# EasyEDA schematic V71_XplainedUltra_CAN_Shield.json
TITLE: V71 XplainedUltra CAN Shield; REV: 1.0; Date: 2023-05-06; Sheet: 1/1; Company: N/A
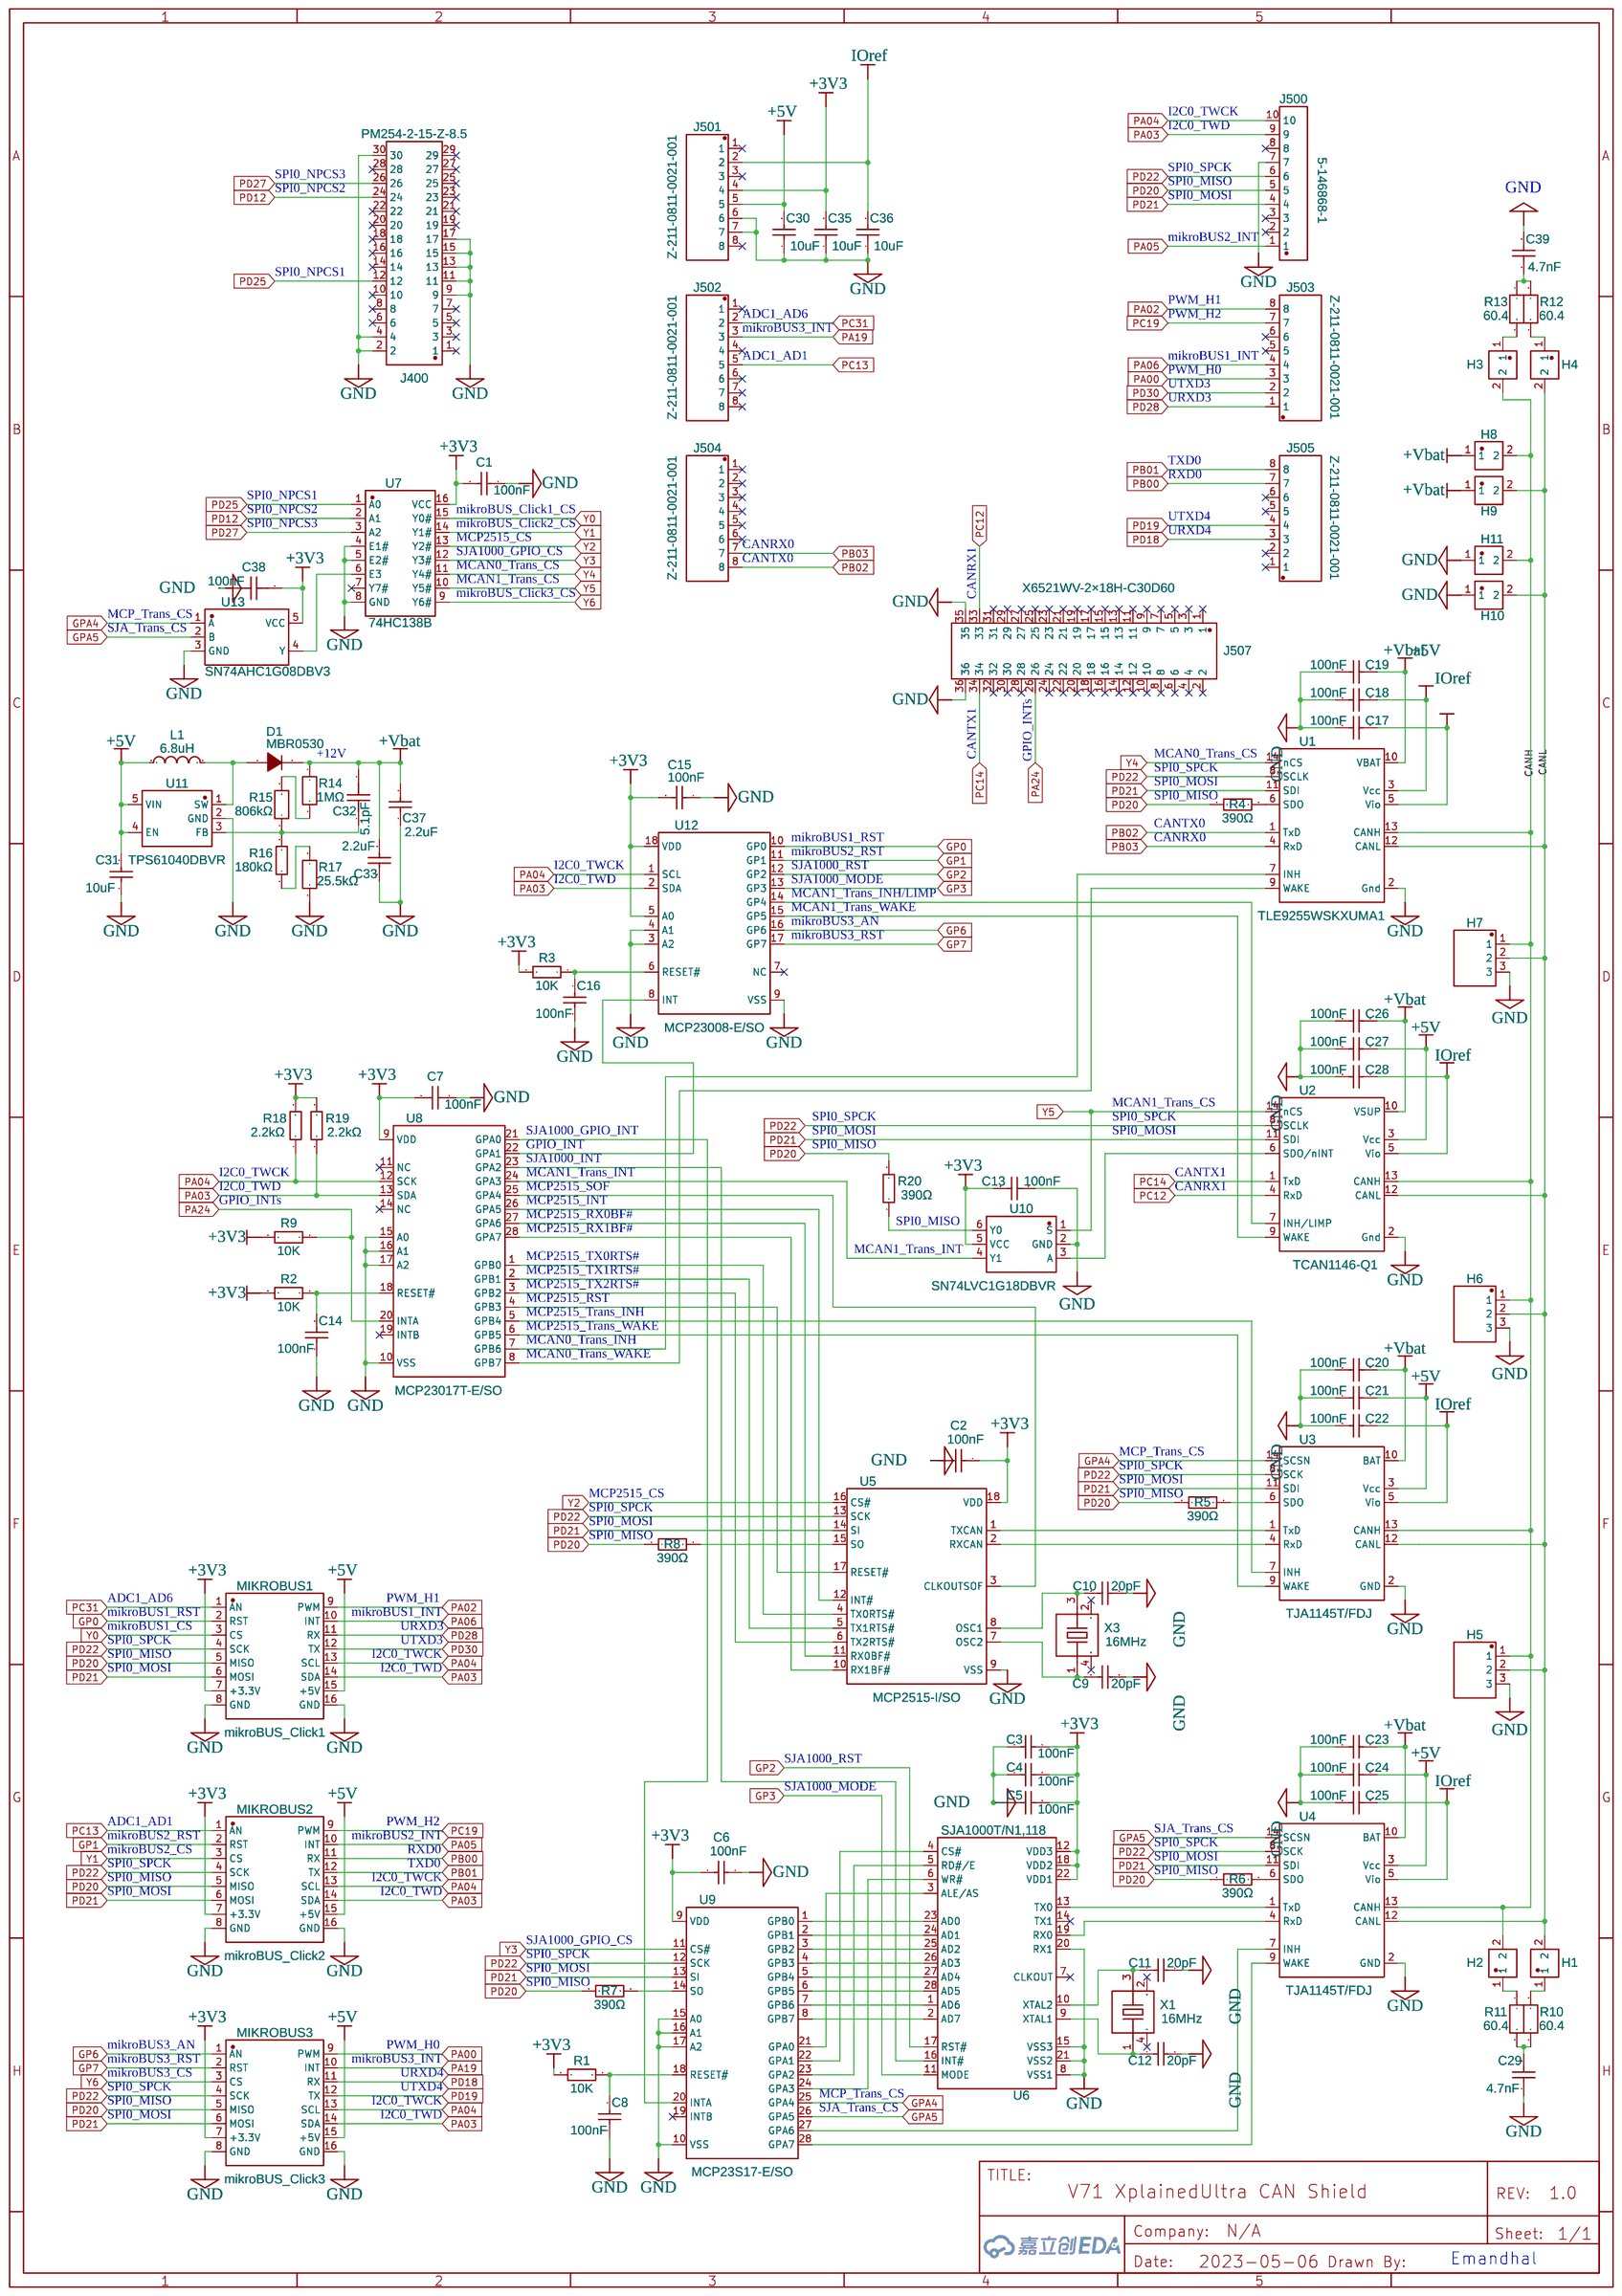
[diagram p0: schematic sheet]

## Parts
C1  100nF  [C0805]
C2  100nF  [C0805]
C3  100nF  [C0805]
C4  100nF  [C0805]
C5  100nF  [C0805]
C6  100nF  [C0805]
C7  100nF  [C0805]
C8  100nF  [C0805]
C9  20pF  [C0603]
C10  20pF  [C0603]
C11  20pF  [C0603]
C12  20pF  [C0603]
C13  100nF  [C0805]
C14  100nF  [C0805]
C15  100nF  [C0805]
C16  100nF  [C0805]
C17  100nF  [C0805]
C18  100nF  [C0805]
C19  100nF  [C0805]
C20  100nF  [C0805]
C21  100nF  [C0805]
C22  100nF  [C0805]
C23  100nF  [C0805]
C24  100nF  [C0805]
C25  100nF  [C0805]
C26  100nF  [C0805]
C27  100nF  [C0805]
C28  100nF  [C0805]
C29  4.7nF  [C0805]
C30  10uF  [C0805]
C31  10uF  [C0805]
C32  5.1pF  [C0805]
C33  2.2uF  [C0805]
C35  10uF  [C0805]
C36  10uF  [C0805]
C37  2.2uF  [C0805]
C38  100nF  [C0805]
C39  4.7nF  [C0805]
D1  MBR0530  [SOD-123_L2.8-W1.8-LS3.7-RD]
H1  X6521WV-2X01H-C30D60  [HDR-TH_2P-P2.54-V-M]
H2  X6521WV-2X01H-C30D60  [HDR-TH_2P-P2.54-V-M]
H3  X6521WV-2X01H-C30D60  [HDR-TH_2P-P2.54-V-M]
H4  X6521WV-2X01H-C30D60  [HDR-TH_2P-P2.54-V-M]
H5  77311-102-03LF  [HDR-TH_3P-P2.54-V-M-1]
H6  77311-102-03LF  [HDR-TH_3P-P2.54-V-M-1]
H7  77311-102-03LF  [HDR-TH_3P-P2.54-V-M-1]
H8  X6521WV-2X01H-C30D60  [HDR-TH_2P-P2.54-V-M]
H9  X6521WV-2X01H-C30D60  [HDR-TH_2P-P2.54-V-M]
H10  X6521WV-2X01H-C30D60  [HDR-TH_2P-P2.54-V-M]
H11  X6521WV-2X01H-C30D60  [HDR-TH_2P-P2.54-V-M]
J400  PM254-2-15-Z-8.5  [HDR-TH_30P-P2.54-V-F-R2-C15-S2.54-2]
J500  5-146868-1  [HDR-TH_10P-P2.54-V-M-1]
J501  Z-211-0811-0021-001  [HDR-TH_8P-P2.54-V-M]
J502  Z-211-0811-0021-001  [HDR-TH_8P-P2.54-V-M]
J503  Z-211-0811-0021-001  [HDR-TH_8P-P2.54-V-M]
J504  Z-211-0811-0021-001  [HDR-TH_8P-P2.54-V-M]
J505  Z-211-0811-0021-001  [HDR-TH_8P-P2.54-V-M]
J507  X6521WV-2×18H-C30D60  [HDR-TH_36P-2.54-V-M-R2-C18-S2.54]
L1  6.8uH  [IND-SMD_L2.0-W1.3]
MIKROBUS1  mikroBUS_Click1  [MIKROE-CLICK-HEADER]
MIKROBUS2  mikroBUS_Click2  [MIKROE-CLICK-HEADER]
MIKROBUS3  mikroBUS_Click3  [MIKROE-CLICK-HEADER]
R1  10K  [R0805]
R2  10K  [R0805]
R3  10K  [R0805]
R4  390Ω  [R0805]
R5  390Ω  [R0805]
R6  390Ω  [R0805]
R7  390Ω  [R0805]
R8  390Ω  [R0805]
R9  10K  [R0805]
R10  60.4  [R0603]
R11  60.4  [R0603]
R12  60.4  [R0603]
R13  60.4  [R0603]
R14  1MΩ  [R0805]
R15  806kΩ  [R0805]
R16  180kΩ  [R0805]
R17  25.5kΩ  [R0805]
R18  2.2kΩ  [R0805]
R19  2.2kΩ  [R0805]
R20  390Ω  [R0805]
U1  TLE9255WSKXUMA1  [SOIC-14_L8.7-W3.9-P1.27-LS6.0-BL]
U2  TCAN1146-Q1  [SOIC-14_L8.7-W3.9-P1.27-LS6.0-BL]
U3  TJA1145T/FDJ  [SOIC-14_L8.7-W3.9-P1.27-LS6.0-BL]
U4  TJA1145T/FDJ  [SOIC-14_L8.7-W3.9-P1.27-LS6.0-BL]
U5  MCP2515-I/SO  [SOIC-18_L11.6-W7.5-P1.27-LS10.3-BL]
U6  SJA1000T/N1,118  [SOIC-28_L17.9-W7.5-P1.27-LS10.3-BL]
U7  74HC138B  [SOP-16_L9.9-W3.9-P1.27-LS6.0-BL]
U8  MCP23017T-E/SO  [SOIC-28_L17.9-W7.5-P1.27-LS10.3-BL]
U9  MCP23S17-E/SO  [SOIC-28_L17.9-W7.5-P1.27-LS10.3-BL]
U10  SN74LVC1G18DBVR  [SOT-23-6_L2.9-W1.6-P0.95-LS2.8-BR]
U11  TPS61040DBVR  [SOT-23-5_L3.0-W1.7-P0.95-LS2.8-BL]
U12  MCP23008-E/SO  [SOIC-18_L11.6-W7.5-P1.27-LS10.3-BL]
U13  SN74AHC1G08DBV3  [SOT-23-5_L2.9-W1.6-P0.95-LS2.8-BR]
X1  16MHz  [CRYSTAL-SMD_4P-L3.2-W2.5-BL-2]
X3  16MHz  [CRYSTAL-SMD_4P-L3.2-W2.5-BL-2]

## Library data of the parts
C1-C8 C13-C28 = CC0805KRX7R9BB104: Supplier: LCSC; Manufacturer: YAGEO(国巨); Supplier Part: C49678; JLCPCB Part Class: Basic Part
C9-C12 = CL10C200JB8NNNC: Supplier: LCSC; Manufacturer: SAMSUNG(三星); Supplier Part: C1648; JLCPCB Part Class: Basic Part
C29 C39 = 0805B472K500NT: Supplier: LCSC; Manufacturer: FH(风华); Supplier Part: C1744; JLCPCB Part Class: Basic Part
C30 C31 C35 C36 = CL21A106KAYNNNE: Supplier: LCSC; Manufacturer: SAMSUNG(三星); Supplier Part: C15850; JLCPCB Part Class: Basic Part
C32 = CC0805CRNPO9BN5R1: Supplier: LCSC; Supplier Part: C519941; Manufacturer: YAGEO(国巨); Contributor: LCSC; JLCPCB Part Class: Extended Part
C33 C37 = 0805F225M500NT: Supplier: LCSC; Manufacturer: FH(风华); Supplier Part: C49217; JLCPCB Part Class: Basic Part
C38 = CC0805KRX7R7BB104: Supplier: LCSC; Supplier Part: C519980; Manufacturer: YAGEO(国巨); JLCPCB Part Class: Extended Part; Contributor: LCSC
D1 = MBR0530: Supplier: LCSC; Manufacturer: CJ(江苏长电/长晶); Supplier Part: C77336; JLCPCB Part Class: Extended Part
H1-H4 H8-H11 = X6521WV-2X01H-C30D60: Supplier: LCSC; Supplier Part: C2883961; Manufacturer: XKB Connectivity(中国星坤); Manufacturer Part: X6521WV-2x01H-C30D60; link: https://atta.szlcsc.com/upload/public/pdf/source/20211009/DE33EBA4104B5B447A7BD8383FBBA145.pdf; Contributor: LCSC; JLCPCB Part Class: Extended Part
H5-H7 = 77311-102-03LF: Supplier: LCSC; Supplier Part: C180248; Manufacturer: Amphenol; Contributor: LCSC; JLCPCB Part Class: Extended Part
J400 = PM254-2-15-Z-8.5: Supplier: LCSC; Supplier Part: C2897416; Manufacturer: HCTL(华灿天禄); Contributor: LCSC; JLCPCB Part Class: Extended Part
J500 = 5-146868-1: Supplier: LCSC; Supplier Part: C429850; Manufacturer: TE Connectivity(美国泰科); Contributor: LCSC; JLCPCB Part Class: Extended Part
J501-J505 = Z-211-0811-0021-001: Supplier: LCSC; Supplier Part: C190820; Manufacturer: Nextron(正凌); Contributor: LCSC; JLCPCB Part Class: Extended Part
J507 = X6521WV-2×18H-C30D60: Supplier: LCSC; Supplier Part: C725890; Manufacturer: XKB Connectivity(中国星坤); Manufacturer Part: X6521WV-2x18H-C30D60; Contributor: LCSC; JLCPCB Part Class: Extended Part
L1 = MLZ2012N6R8LT000: Supplier: LCSC; Supplier Part: C82157; Manufacturer: TDK; Contributor: LCSC; JLCPCB Part Class: Extended Part
MIKROBUS1-MIKROBUS3 = MIKROE-CLICK-HEADER: Contributor: philbobagins
R1-R3 R9 = RT0805BRD0710KL: Supplier: LCSC; Manufacturer: YAGEO(国巨); Supplier Part: C110775; JLCPCB Part Class: Extended Part; Resistance: 10kΩ
R4-R8 R20 = 0805W8F3900T5E: Supplier: LCSC; Manufacturer: UNI-ROYAL(厚声); Supplier Part: C17655; Resistance (Ohms): 390; JLCPCB Part Class: Basic Part
R10-R13 = AC0603DR-0760R4L: Supplier: LCSC; Supplier Part: C227513; Manufacturer: YAGEO(国巨); Contributor: LCSC; JLCPCB Part Class: Extended Part; Resistance: 60.4Ω
R14 = CR-05FL7----1M: Supplier: LCSC; Supplier Part: C416080; Manufacturer: Viking(光颉); Resistance (Ohms): 1M; Contributor: LCSC; JLCPCB Part Class: Extended Part
R15 = WR08X8063FTL: Supplier: LCSC; Supplier Part: C368003; Manufacturer: Walsin(华新科); Resistance (Ohms): 806K; Contributor: LCSC; JLCPCB Part Class: Extended Part
R16 = RK73B2ATTD184J: Supplier: LCSC; Supplier Part: C316809; Manufacturer: KOA; Resistance (Ohms): 180K; Contributor: LCSC; JLCPCB Part Class: Extended Part
R17 = TE05H2552BT: Supplier: LCSC; Supplier Part: C880427; Manufacturer: FH(风华); Contributor: LCSC; JLCPCB Part Class: Extended Part
R18 R19 = AR05BTB2201: Supplier: LCSC; Supplier Part: C374634; Manufacturer: Viking(光颉); Resistance (Ohms): 2.2K; Contributor: LCSC; JLCPCB Part Class: Extended Part
U1 = TLE9255WSKXUMA1: Supplier: LCSC; Supplier Part: C2671952; Manufacturer: Infineon(英飞凌); Contributor: Emandhal; JLCPCB Part Class: Extended Part; link: https://www.infineon.com/dgdl/Infineon-TLE9255W-DataSheet-v01_04-EN.pdf?fileId=5546d4625bd71aa0015c10eaeaf93ee5
U2 = TCAN1146-Q1: Contributor: Emandhal; Manufacturer Part: TCAN1146D-Q1; Supplier: LCSC; Supplier Part: C3234147; Manufacturer: Texas Instruments; link: https://www.ti.com/lit/ds/symlink/tcan1145-q1.pdf?ts=1683312657919
U3 U4 = TJA1145T/FDJ: Supplier: LCSC; Manufacturer: NXP(恩智浦); Supplier Part: C131479; JLCPCB Part Class: Extended Part; link: https://www.nxp.com/docs/en/data-sheet/TJA1145.pdf; Contributor: Emandhal
U5 = MCP2515-I/SO: Supplier: LCSC; Manufacturer: MICROCHIP(美国微芯); Supplier Part: C12368; JLCPCB Part Class: Extended Part; link: https://ww1.microchip.com/downloads/en/DeviceDoc/MCP2515-Stand-Alone-CAN-Controller-with-SPI-20001801J.pdf; Contributor: Emandhal
U6 = SJA1000T/N1,118: Supplier: LCSC; Manufacturer: NXP(恩智浦); Supplier Part: C6910; JLCPCB Part Class: Extended Part; link: https://www.nxp.com/docs/en/data-sheet/SJA1000.pdf; Contributor: Emandhal
U7 = 74HC138B: Supplier: LCSC; Supplier Part: C2906780; Manufacturer: FM(富满); Contributor: LCSC; JLCPCB Part Class: Extended Part
U8 = MCP23017T-E/SO: Supplier: LCSC; Supplier Part: C629440; Manufacturer: MICROCHIP(美国微芯); link: https://atta.szlcsc.com/upload/public/pdf/source/20220321/B5AAACE49E79FD7FA33208C446BB37B2.pdf; Contributor: Emandhal; JLCPCB Part Class: Extended Part
U9 = MCP23S17-E/SO: Supplier: LCSC; Manufacturer: MICROCHIP(美国微芯); Contributor: Emandhal; Supplier Part: C145413; JLCPCB Part Class: Extended Part
U10 = SN74LVC1G18DBVR: Supplier: LCSC; Supplier Part: C2674690; Manufacturer: TI(德州仪器); JLCPCB Part Class: Extended Part; Contributor: LCSC
U11 = TPS61040DBVR: Supplier: LCSC; Manufacturer: TI(德州仪器); Supplier Part: C7722; JLCPCB Part Class: Basic Part
U12 = MCP23008-E/SO: Supplier: LCSC; Manufacturer: MICROCHIP(美国微芯); Contributor: Emandhal; Supplier Part: C92253; JLCPCB Part Class: Extended Part
U13 = SN74AHC1G08DBV3: Supplier: LCSC; Supplier Part: C2877867; Manufacturer: TI(德州仪器); link: https://atta.szlcsc.comnull; Contributor: LCSC; JLCPCB Part Class: Extended Part
X1 X3 = NX3225SA-16MHZ-STD-CSR-6: Supplier: LCSC; Supplier Part: C880097; Manufacturer: NDK; Manufacturer Part: NX3225SA-16MHz-STD-CSR-6; Contributor: Emandhal; JLCPCB Part Class: Extended Part

## Nets
+3V3: C1.2 C2.1 C3.1 C4.1 C5.1 C6.2 C7.2 C13.2 C15.2 C35.2 C38.1 J501.4 MIKROBUS1.7(+3.3V) MIKROBUS2.7(+3.3V) MIKROBUS3.7(+3.3V) R1.2 R2.2 R3.2 R9.2 R18.2 R19.2 U5.18(VDD) U6.12(VDD3) U6.18(VDD2) U6.22(VDD1) U7.16(VCC) U8.9(VDD) U9.9(VDD) U10.5(VCC) U12.5(A0) U12.18(VDD) U13.5(VCC)
+5V: C18.1 C21.1 C24.1 C27.1 C30.2 C31.2 J501.5 L1.1 MIKROBUS1.15(+5V) MIKROBUS2.15(+5V) MIKROBUS3.15(+5V) U1.3(Vcc) U2.3(Vcc) U3.3(Vcc) U4.3(Vcc) U11.4(EN) U11.5(VIN)
+Vbat: C19.1 C20.1 C23.1 C26.1 C32.2 C33.2 C37.2 D1.1(C) H8.1 H9.1 R14.2 U1.10(VBAT) U2.10(VSUP) U3.10(BAT) U4.10(BAT)
GND: C1.1 C2.2 C3.2 C4.2 C5.2 C6.1 C7.1 C8.1 C9.2 C10.2 C11.2 C12.2 C13.1 C14.1 C15.1 C16.1 C17.2 C18.2 C19.2 C20.2 C21.2 C22.2 C23.2 C24.2 C25.2 C26.2 C27.2 C28.2 C29.1 C30.1 C31.1 C33.1 C35.1 C36.1 C37.1 C38.2 C39.2 H5.3 H6.3 H7.3 H10.1 H11.1 J400.2 J400.4 J400.9 J400.11 J400.13 J400.15 J400.17 J400.30 J500.7 J501.6 J501.7 J507.35 J507.36 MIKROBUS1.8(GND) MIKROBUS1.16(GND) MIKROBUS2.8(GND) MIKROBUS2.16(GND) MIKROBUS3.8(GND) MIKROBUS3.16(GND) R17.1 U1.2(Gnd) U2.2(Gnd) U3.2(GND) U4.2(GND) U5.9(VSS) U6.8(VSS1) U6.15(VSS3) U6.20(RX1) U6.21(VSS2) U7.4(E1#) U7.5(E2#) U7.8(GND) U8.10(VSS) U8.15(A0) U8.16(A1) U8.17(A2) U9.10(VSS) U9.15(A0) U9.16(A1) U9.17(A2) U10.2(GND) U11.2(GND) U12.3(A2) U12.4(A1) U12.9(VSS) U13.3(GND)
CANH: H2.2 H3.2 H5.1 H6.1 H7.1 H8.2 H11.2 U1.13(CANH) U2.13(CANH) U3.13(CANH) U4.13(CANH)
CANL: H1.2 H4.2 H5.2 H6.2 H7.2 H9.2 H10.2 U1.12(CANL) U2.12(CANL) U3.12(CANL) U4.12(CANL)
GP0: MIKROBUS1.2(RST) U12.10(GP0)
GP1: MIKROBUS2.2(RST) U12.11(GP1)
GP2: U6.17(RST#) U12.12(GP2)
GP3: U6.11(MODE) U12.13(GP3)
GP6: MIKROBUS3.1(AN) U12.16(GP6)
GP7: MIKROBUS3.2(RST) U12.17(GP7)
GPA4: U3.14(SCSN) U9.25(GPA4) U13.1(A)
GPA5: U4.14(SCSN) U9.26(GPA5) U13.2(B)
IOref: C17.1 C22.1 C25.1 C28.1 C36.2 J501.2 U1.5(Vio) U2.5(Vio) U3.5(Vio) U4.5(Vio)
PA00: J503.3 MIKROBUS3.9(PWM)
PA02: J503.8 MIKROBUS1.9(PWM)
PA03: J500.9 MIKROBUS1.14(SDA) MIKROBUS2.14(SDA) MIKROBUS3.14(SDA) R19.1 U8.13(SDA) U12.2(SDA)
PA04: J500.10 MIKROBUS1.13(SCL) MIKROBUS2.13(SCL) MIKROBUS3.13(SCL) R18.1 U8.12(SCK) U12.1(SCL)
PA05: J500.1 MIKROBUS2.10(INT)
PA06: J503.4 MIKROBUS1.10(INT)
PA19: J502.3 MIKROBUS3.10(INT)
PA24: J507.26 R9.1 U8.20(INTA)
PB00: J505.7 MIKROBUS2.11(RX)
PB01: J505.8 MIKROBUS2.12(TX)
PB02: J504.8 U1.1(TxD)
PB03: J504.7 U1.4(RxD)
PC12: J507.33 U2.4(RxD)
PC13: J502.5 MIKROBUS2.1(AN)
PC14: J507.34 U2.1(TxD)
PC19: J503.7 MIKROBUS2.9(PWM)
PC31: J502.2 MIKROBUS1.1(AN)
PD12: J400.24 U7.2(A1)
PD18: J505.3 MIKROBUS3.11(RX)
PD19: J505.4 MIKROBUS3.12(TX)
PD20: J500.5 MIKROBUS1.5(MISO) MIKROBUS2.5(MISO) MIKROBUS3.5(MISO) R4.1 R5.1 R6.1 R7.1 R8.1 R20.2
PD21: J500.4 MIKROBUS1.6(MOSI) MIKROBUS2.6(MOSI) MIKROBUS3.6(MOSI) U1.11(SDI) U2.11(SDI) U3.11(SDI) U4.11(SDI) U5.14(SI) U9.13(SI)
PD22: J500.6 MIKROBUS1.4(SCK) MIKROBUS2.4(SCK) MIKROBUS3.4(SCK) U1.8(SCLK) U2.8(SCLK) U3.8(SCK) U4.8(SCK) U5.13(SCK) U9.12(SCK)
PD25: J400.12 U7.1(A0)
PD27: J400.26 U7.3(A2)
PD28: J503.1 MIKROBUS1.11(RX)
PD30: J503.2 MIKROBUS1.12(TX)
Y0: MIKROBUS1.3(CS) U7.15(Y0#)
Y1: MIKROBUS2.3(CS) U7.14(Y1#)
Y2: U5.16(CS#) U7.13(Y2#)
Y3: U7.12(Y3#) U9.11(CS#)
Y4: U1.14(nCS) U7.11(Y4#)
Y5: U2.14(nCS) U7.10(Y5#) U10.1(S)
Y6: MIKROBUS3.3(CS) U7.9(Y6#)
Net-(C8-2): C8.2 R1.1 U9.18(RESET#)
Net-(C9-1): C9.1 U5.7(OSC2) X3.1
Net-(C10-1): C10.1 U5.8(OSC1) X3.3
Net-(C11-1): C11.1 U6.10(XTAL2) X1.3
Net-(C12-1): C12.1 U6.9(XTAL1) X1.1
Net-(C14-2): C14.2 R2.1 U8.18(RESET#)
Net-(C16-2): C16.2 R3.1 U12.6(RESET#)
Net-(C29-2): C29.2 R10.1 R11.2
Net-(C32-1): C32.1 R15.1 R16.2 U11.3(FB)
Net-(C39-1): C39.1 R12.2 R13.1
Net-(D1-2): D1.2(A) L1.2 U11.1(SW)
Net-(H1-1): H1.1 R10.2
Net-(H2-1): H2.1 R11.1
Net-(H3-1): H3.1 R13.2
Net-(H4-1): H4.1 R12.1
Net-(R4-2): R4.2 U1.6(SDO)
Net-(R5-2): R5.2 U3.6(SDO)
Net-(R6-2): R6.2 U4.6(SDO)
Net-(R7-2): R7.2 U9.14(SO)
Net-(R8-2): R8.2 U5.15(SO)
Net-(R14-1): R14.1 R15.2
Net-(R16-1): R16.1 R17.2
Net-(R20-1): R20.1 U10.6(Y0)
Net-(U1-7): U1.7(INH) U8.7(GPB6)
Net-(U1-9): U1.9(WAKE) U8.8(GPB7)
Net-(U2-6): U2.6(SDO/nINT) U10.3(A)
Net-(U2-7): U2.7(INH/LIMP) U12.14(GP4)
Net-(U2-9): U2.9(WAKE) U12.15(GP5)
Net-(U3-1): U3.1(TxD) U5.1(TXCAN)
Net-(U3-4): U3.4(RxD) U5.2(RXCAN)
Net-(U3-7): U3.7(INH) U8.5(GPB4)
Net-(U3-9): U3.9(WAKE) U8.6(GPB5)
Net-(U4-1): U4.1(TxD) U6.13(TX0)
Net-(U4-4): U4.4(RxD) U6.19(RX0)
Net-(U4-7): U4.7(INH) U9.27(GPA6)
Net-(U4-9): U4.9(WAKE) U9.28(GPA7)
Net-(U5-3): U5.3(CLKOUTSOF) U8.25(GPA4)
Net-(U5-4): U5.4(TX0RTS#) U8.1(GPB0)
Net-(U5-5): U5.5(TX1RTS#) U8.2(GPB1)
Net-(U5-6): U5.6(TX2RTS#) U8.3(GPB2)
Net-(U5-10): U5.10(RX1BF#) U8.28(GPA7)
Net-(U5-11): U5.11(RX0BF#) U8.27(GPA6)
Net-(U5-12): U5.12(INT#) U8.26(GPA5)
Net-(U5-17): U5.17(RESET#) U8.4(GPB3)
Net-(U6-1): U6.1(AD6) U9.7(GPB6)
Net-(U6-2): U6.2(AD7) U9.8(GPB7)
Net-(U6-3): U6.3(ALE/AS) U9.21(GPA0)
Net-(U6-4): U6.4(CS#) U9.22(GPA1)
Net-(U6-5): U6.5(RD#/E) U9.23(GPA2)
Net-(U6-6): U6.6(WR#) U9.24(GPA3)
Net-(U6-16): U6.16(INT#) U8.23(GPA2)
Net-(U6-23): U6.23(AD0) U9.1(GPB0)
Net-(U6-24): U6.24(AD1) U9.2(GPB1)
Net-(U6-25): U6.25(AD2) U9.3(GPB2)
Net-(U6-26): U6.26(AD3) U9.4(GPB3)
Net-(U6-27): U6.27(AD4) U9.5(GPB4)
Net-(U6-28): U6.28(AD5) U9.6(GPB5)
Net-(U7-6): U7.6(E3) U13.4(Y)
Net-(U8-21): U8.21(GPA0) U9.20(INTA)
Net-(U8-22): U8.22(GPA1) U12.8(INT)
Net-(U8-24): U8.24(GPA3) U10.4(Y1)

Not connected (* = marked no-connect by the designer): J400 1* 3* 5* 6* 7* 8* 10* 14* 16* 18* 19* 20* 21* 22* 23* 25* 27* 28* 29*; J500 2* 3* 8*; J501 1* 3* 8*; J502 1* 4* 6* 7* 8*; J503 5* 6*; J504 1* 2* 3* 4* 5* 6*; J505 1* 2* 5* 6*; J507 1* 2* 3* 4* 5* 6* 7* 8* 9* 10* 11* 12* 13* 14* 15* 16* 17* 18* 19* 20* 21* 22* 23* 24* 25* 27* 28* 29* 30* 31* 32*; U6 7(CLKOUT)* 14(TX1)*; U7 7(Y7#)*; U8 11(NC)* 14(NC)* 19(INTB)*; U9 19(INTB)*; U12 7(NC)*; X1 2(GND)* 4(GND)*; X3 2(GND)* 4(GND)*

## Notes on the sheet
- I2C0_TWCK
- I2C0_TWD
- SPI0_SPCK
- SPI0_NPCS3
- SPI0_MISO
- SPI0_NPCS2
- SPI0_MOSI
- mikroBUS2_INT
- SPI0_NPCS1
- ADC1_AD6
- PWM_H1
- PWM_H2
- mikroBUS3_INT
- ADC1_AD1
- mikroBUS1_INT
- PWM_H0
- URXD3
- UTXD3
- TXD0
- RXD0
- SPI0_NPCS1
- SPI0_NPCS2
- mikroBUS_Click1_CS
- SPI0_NPCS3
- mikroBUS_Click2_CS
- URXD4
- UTXD4
- MCP2515_CS
- CANRX0
- SJA1000_GPIO_CS
- CANTX0
- MCAN0_Trans_CS
- MCAN1_Trans_CS
- mikroBUS_Click3_CS
- CANRX1
- MCP_Trans_CS
- SJA_Trans_CS
- +12V
- MCAN0_Trans_CS
- CANTX1
- GPIO_INTs
- SPI0_SPCK
- SPI0_MOSI
- SPI0_MISO
- CANTX0
- mikroBUS1_RST
- CANRX0
- mikroBUS2_RST
- I2C0_TWCK
- SJA1000_RST
- I2C0_TWD
- SJA1000_MODE
- MCAN1_Trans_INH/LIMP
- MCAN1_Trans_WAKE
- mikroBUS3_AN
- mikroBUS3_RST
- MCAN1_Trans_CS
- SPI0_SPCK
- SPI0_SPCK
- SJA1000_GPIO_INT
- SPI0_MOSI
- SPI0_MOSI
- GPIO_INT
- SPI0_MISO
- I2C0_TWCK
- MCAN1_Trans_INT
- SJA1000_INT
- CANTX1
- I2C0_TWD
- MCP2515_SOF
- CANRX1
- GPIO_INTs
- MCP2515_INT
- MCP2515_RX0BF#
- SPI0_MISO
- MCP2515_RX1BF#
- MCAN1_Trans_INT
- MCP2515_TX0RTS#
- MCP2515_TX1RTS#
- MCP2515_TX2RTS#
- MCP2515_RST
- MCP2515_Trans_INH
- MCP2515_Trans_WAKE
- MCAN0_Trans_INH
- MCAN0_Trans_WAKE
- MCP_Trans_CS
- SPI0_SPCK
- SPI0_MOSI
- MCP2515_CS
- SPI0_MISO
- SPI0_SPCK
- SPI0_MISO
- SPI0_MOSI
- ADC1_AD6
- PWM_H1
- mikroBUS1_RST
- mikroBUS1_INT
- mikroBUS1_CS
- URXD3
- SPI0_SPCK
- UTXD3
- SPI0_MISO
- I2C0_TWCK
- SPI0_MOSI
- I2C0_TWD
- SJA1000_RST
- SJA1000_MODE
- ADC1_AD1
- PWM_H2
- SJA_Trans_CS
- mikroBUS2_RST
- mikroBUS2_INT
- SPI0_SPCK
- SPI0_SPCK
- mikroBUS2_CS
- RXD0
- TXD0
- SPI0_MOSI
- SPI0_MISO
- I2C0_TWCK
- SPI0_MISO
- SPI0_MOSI
- I2C0_TWD
- SJA1000_GPIO_CS
- SPI0_SPCK
- SPI0_MOSI
- SPI0_MISO
- mikroBUS3_AN
- PWM_H0
- mikroBUS3_RST
- mikroBUS3_INT
- mikroBUS3_CS
- URXD4
- SPI0_SPCK
- UTXD4
- MCP_Trans_CS
- SPI0_MISO
- I2C0_TWCK
- SJA_Trans_CS
- SPI0_MOSI
- I2C0_TWD
- Emandhal
